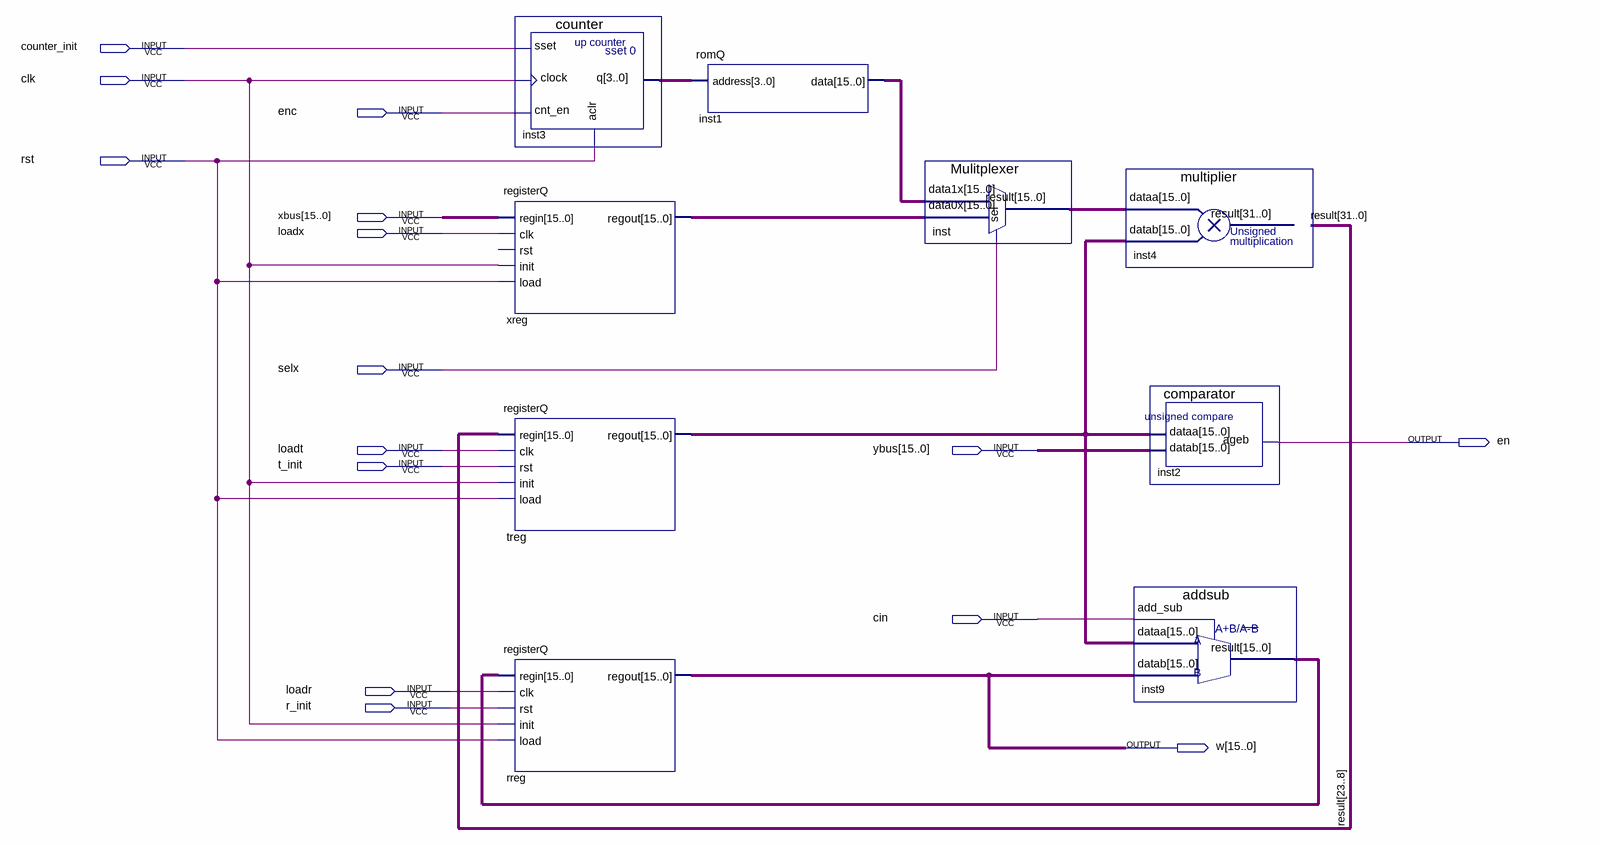
[diagram p0: schematic sheet]
// Quartus schematic datapath.bdf as structural Verilog: 9 symbols, 15 pins
module datapath (
  input  counter_init,
  input  clk,
  input  enc,
  input  rst,
  input  [15:0] xbus,
  input  loadx,
  input  selx,
  input  loadt,
  input  [15:0] ybus,
  input  t_init,
  input  cin,
  input  loadr,
  input  r_init,
  output en,
  output [15:0] w
);

  wire [3:0] inst3_q;
  wire [15:0] inst1_data, inst9_result, inst_result, treg_regout, xreg_regout;
  wire [31:0] result;

  registerQ xreg (.regin(xbus), .clk(loadx), .init(clk), .load(rst), .regout(xreg_regout));  // open: rst
  registerQ treg (.regin(result[23:8]), .clk(loadt), .rst(t_init), .init(clk), .load(rst), .regout(treg_regout));
  registerQ rreg (.regin(inst9_result), .clk(loadr), .rst(r_init), .init(clk), .load(rst), .regout(w));
  counter inst3 (.sset(counter_init), .clock(clk), .cnt_en(enc), .aclr(rst), .q(inst3_q));
  romQ inst1 (.address(inst3_q), .data(inst1_data));
  Mulitplexer inst (.data1x(inst1_data), .data0x(xreg_regout), .sel(selx), .result(inst_result));
  multiplier inst4 (.dataa(inst_result), .datab(treg_regout), .result(result));
  addsub inst9 (.add_sub(cin), .dataa(treg_regout), .datab(w), .result(inst9_result));
  comparator inst2 (.dataa(treg_regout), .datab(ybus), .ageb(en));
endmodule
